# Altium schematic sheet out_drv.SchDoc: =ProjectName+'_'+Revision+'_'+VariantName
size A3; Date: [Sheet Date]; Author: [Sheet Author]; DocumentNumber: 5; Revision: 0; SheetNumber: 5; SheetTotal: 5
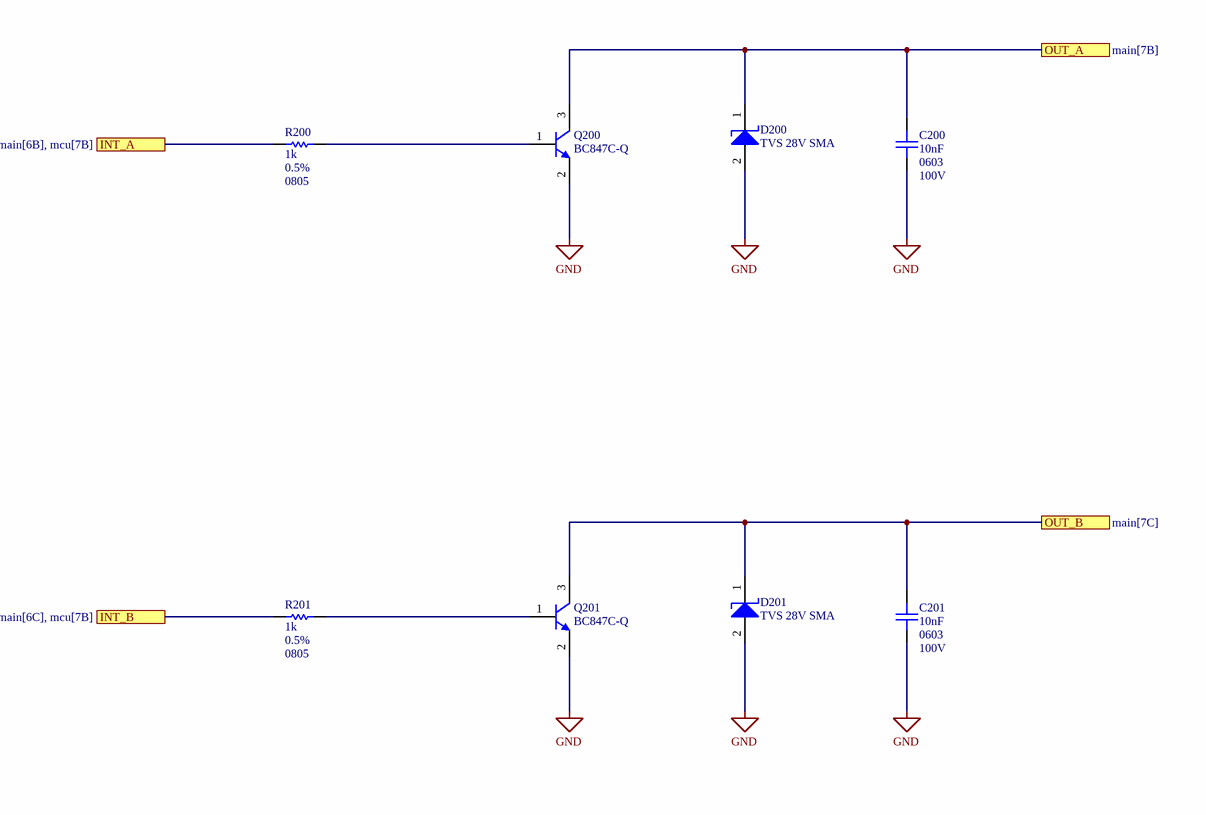
[diagram p0: out_drv.SchDoc, left]

## Parts
C200  Case/Package: 0603  Op Voltage: 100V  [CER0603]  (hidden comment: 10nF)
C201  Case/Package: 0603  Op Voltage: 100V  [CER0603]  (hidden comment: 10nF)
D200  value TVS 28V SMA  [DO-214AC_SMA]  (hidden comment: SMD/PTH TVS Unidirectional Diode)
D201  value TVS 28V SMA  [DO-214AC_SMA]  (hidden comment: SMD/PTH TVS Unidirectional Diode)
Q200  value BC847C-Q  [SOT95P230X110-3N]  (hidden comment: NPN Transistor SMD)
Q201  value BC847C-Q  [SOT95P230X110-3N]  (hidden comment: NPN Transistor SMD)
R200  value 1k  Tolerance: 0.5%  Case/Package: 0805  [Res0603]  (hidden comment: SMD Resistor)
R201  value 1k  Tolerance: 0.5%  Case/Package: 0805  [Res0603]  (hidden comment: SMD Resistor)

## Ports
INT_A (see main[6B], mcu[7B]), INT_B (see main[6C], mcu[7B]), OUT_A (see main[7B]), OUT_B (see main[7C])

## Nets
GND: C200.2 C201.2 D200.2(A) D201.2(A) Q200.2(E) Q201.2(E)
INT_A: R200.1 ; port INT_A
INT_B: R201.1 ; port INT_B
OUT_A: C200.1 D200.1(K) Q200.3(C) ; port OUT_A
OUT_B: C201.1 D201.1(K) Q201.3(C) ; port OUT_B
NetQ200_1: Q200.1(B) R200.2
NetQ201_1: Q201.1(B) R201.2

## Notes on the sheet
- Proj
- Title:
- Approved:
- Sheet
- File Name:
- Rev:
- Author:
- Date:
- Size:
- A3
- Number:

## Library data of the parts
C200 C201 = GCM188R72A103KA37: MLCC Automotive, 10nF, 0603, 100V, 10%, X7R; MFG1: MURATA; Min Op# Temp °C: -55; Max Op# temp °C: 125; Qualification: AEC-Q200; MPN1: GCM188R72A103KA37; Value: 10nF; Tolerance: 10%; Dielectric: X7R; Supplier: Mouser; Supplier Part Number: 81-GCM188R72A103KA7D; Supplier URL: https://www.mouser.it/ProductDetail/Murata-Electronics/GCM188R72A103KA37D?qs=aEuGZpxfbxXMjTExujWHsg%3D%3D; Datasheet URL: https://www.mouser.it/datasheet/2/281/1/GCM188R72A103KA37_01C-3144519.pdf; Technology: Powertrain/Safety for Automotive
D200 D201 = SMA6T28AY: TVS Uniir 28V SMA; MFG1: ST; 10/1000us Power: 0.6Kw; 8/20us Power: 4KW; Stand-Off Voltage: 24V; Min Op# Temp °C: -55; Max Op# temp °C: 150; Qualification: AEC-Q101; MPN1: SMA6T28AY; Case/Package: SMA/DO-214AC; Type: Unidirectional; Supplier: Mouser; Supplier Part Number: 511-SMA6T28AY; Supplier URL: https://www.mouser.it/ProductDetail/STMicroelectronics/SMAJ30A-TR?qs=zr%2F4QzOm779pW41kykOibw%3D%3D; Datasheet URL: https://www.mouser.it/datasheet/2/389/sma6ty-1850088.pdf
Q200 Q201 = NEXPERIA: NPN general purpose transistors; MPN1: BC847C-QR; Vce Max (V): 45; Ic (mA): 100; Hfe (min): 520; Power Diss (mW): 250; Min Op# Temp °C: -65; Max Op# temp °C: 150; Qualification: AEC-Q101; Manufacturer: *; PN: *; MFG1: NEXPERIA; MFG2: Diodes; MPN2: BC847C-Q; Case/Package: SOT23-3; Type: NPN; Supplier: Mouser; Supplier Part Number: 771-BC847C-QR; Supplier URL: https://www.mouser.it/ProductDetail/Nexperia/BC847C-QR?qs=e8oIoAS2J1RqA3Lgar2wrA%3D%3D; Manufacturer URL: https://www.nexperia.com/search?q=BC847C-Q&searchCategory=
R200 R201 = ERJ-UP6D1001V: Thick Film SM Chip Resistors, 1K, 0805, ±0.5%, 1/2W; MFG1: PANASONIC; Power: 500mW; Temp# Coeffiient (PPM/C): 100; Min Op# Temp °C: -55; Max Op# temp °C: 155; Qualification: AEC-Q200; MPN1: ERJ-UP6D1001V; Supplier: Mouser; Supplier Part Number: 667-ERJ-UP6D1001V; Supplier URL: https://www.mouser.it/ProductDetail/Panasonic/ERJ-UP6D1001V?qs=sGAEpiMZZMvdGkrng054t2cqbZCzJY7NErLgAwiDoTXwln0CjOTO8w%3D%3D; Datasheet URL: https://www.mouser.com/catalog/specsheets/Panasonic_03-31-2024_Resistor_Anti-Sulfur(ERJ-UP6D-Series).pdf?_gl=1*1e8nwi8*_gcl_aw*R0NMLjE3Njc5NTQ2NTkuQ2p3S0NBaUE2NExMQmhCaEVpd0EtUHhndXhkNEYtbVB4TUc1OThEMlhWWVZvVEZGVXVGM1djYmUtdlk1a3VMZFRfZGNHclBMelhFSjRSb0NH; Technology: Thick Film